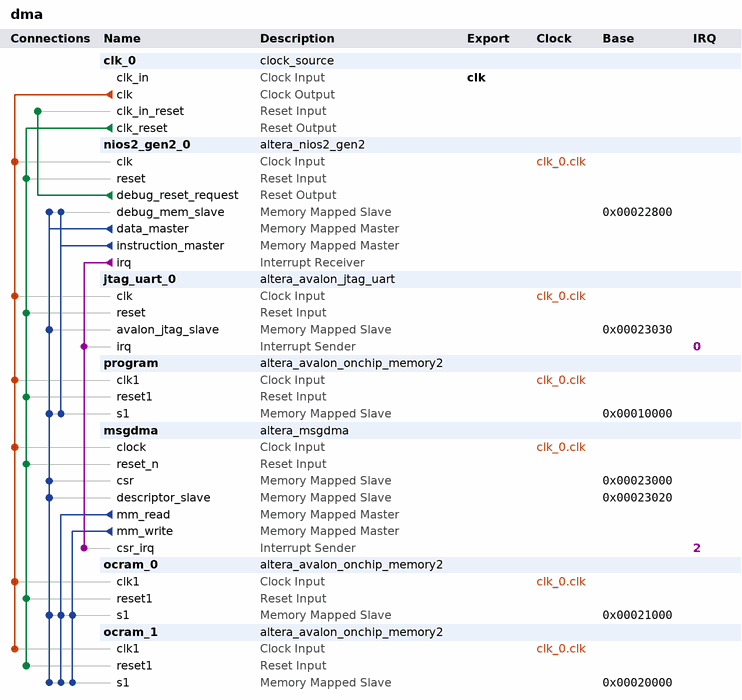
[diagram p0: system contents]
# Platform Designer (Qsys) system dma, MAX 10 10M50DAF484C6GES
# Parameters at their usual value, and those the tool derives, are not listed.
package require -exact qsys 22.1
create_system dma
set_project_property DEVICE_FAMILY {MAX 10}
set_project_property DEVICE 10M50DAF484C6GES

add_instance clk_0 clock_source 22.1
set_instance_parameter_value clk_0 clockFrequency 50000000

add_instance nios2_gen2_0 altera_nios2_gen2 22.1
set_instance_parameter_value nios2_gen2_0 dcache_size 2048
set_instance_parameter_value nios2_gen2_0 exceptionSlave program.s1
set_instance_parameter_value nios2_gen2_0 icache_size 4096
set_instance_parameter_value nios2_gen2_0 impl Fast
set_instance_parameter_value nios2_gen2_0 resetSlave program.s1

add_instance jtag_uart_0 altera_avalon_jtag_uart 22.1
set_instance_parameter_value jtag_uart_0 simInteractiveOptions NO_INTERACTIVE_WINDOWS

add_instance program altera_avalon_onchip_memory2 22.1
set_instance_parameter_value program dataWidth 32
set_instance_parameter_value program dualPort false
set_instance_parameter_value program initMemContent true
set_instance_parameter_value program initializationFileName onchip_mem.hex
set_instance_parameter_value program memorySize 40960

add_instance msgdma altera_msgdma 22.1
set_instance_parameter_value msgdma BURST_ENABLE 0
set_instance_parameter_value msgdma DATA_FIFO_DEPTH 32
set_instance_parameter_value msgdma DATA_WIDTH 32
set_instance_parameter_value msgdma DESCRIPTOR_FIFO_DEPTH 128
set_instance_parameter_value msgdma ENHANCED_FEATURES 0
set_instance_parameter_value msgdma ERROR_ENABLE 0
set_instance_parameter_value msgdma MAX_BURST_COUNT 2
set_instance_parameter_value msgdma MAX_BYTE 1024
set_instance_parameter_value msgdma MODE 0
set_instance_parameter_value msgdma PACKET_ENABLE 0
set_instance_parameter_value msgdma TRANSFER_TYPE {Aligned Accesses}

add_instance ocram_0 altera_avalon_onchip_memory2 22.1
set_instance_parameter_value ocram_0 dataWidth 32
set_instance_parameter_value ocram_0 dualPort false
set_instance_parameter_value ocram_0 initMemContent true
set_instance_parameter_value ocram_0 initializationFileName onchip_mem.hex
set_instance_parameter_value ocram_0 memorySize 4096

add_instance ocram_1 altera_avalon_onchip_memory2 22.1
set_instance_parameter_value ocram_1 dataWidth 32
set_instance_parameter_value ocram_1 dualPort false
set_instance_parameter_value ocram_1 initMemContent true
set_instance_parameter_value ocram_1 initializationFileName onchip_mem.hex
set_instance_parameter_value ocram_1 memorySize 4096

# connections
add_connection clk_0.clk jtag_uart_0.clk clock
add_connection clk_0.clk msgdma.clock clock
add_connection clk_0.clk nios2_gen2_0.clk clock
add_connection clk_0.clk ocram_0.clk1 clock
add_connection clk_0.clk ocram_1.clk1 clock
add_connection clk_0.clk program.clk1 clock
add_connection clk_0.clk_reset jtag_uart_0.reset reset
add_connection clk_0.clk_reset msgdma.reset_n reset
add_connection clk_0.clk_reset nios2_gen2_0.reset reset
add_connection clk_0.clk_reset ocram_0.reset1 reset
add_connection clk_0.clk_reset ocram_1.reset1 reset
add_connection clk_0.clk_reset program.reset1 reset
add_connection nios2_gen2_0.debug_reset_request clk_0.clk_in_reset reset
add_connection msgdma.mm_read ocram_0.s1 avalon
set_connection_parameter_value msgdma.mm_read/ocram_0.s1 baseAddress 0x00021000
add_connection msgdma.mm_read ocram_1.s1 avalon
set_connection_parameter_value msgdma.mm_read/ocram_1.s1 baseAddress 0x00020000
add_connection msgdma.mm_write ocram_0.s1 avalon
set_connection_parameter_value msgdma.mm_write/ocram_0.s1 baseAddress 0x00021000
add_connection msgdma.mm_write ocram_1.s1 avalon
set_connection_parameter_value msgdma.mm_write/ocram_1.s1 baseAddress 0x00020000
add_connection nios2_gen2_0.data_master jtag_uart_0.avalon_jtag_slave avalon
set_connection_parameter_value nios2_gen2_0.data_master/jtag_uart_0.avalon_jtag_slave baseAddress 0x00023030
add_connection nios2_gen2_0.data_master msgdma.csr avalon
set_connection_parameter_value nios2_gen2_0.data_master/msgdma.csr baseAddress 0x00023000
add_connection nios2_gen2_0.data_master msgdma.descriptor_slave avalon
set_connection_parameter_value nios2_gen2_0.data_master/msgdma.descriptor_slave baseAddress 0x00023020
add_connection nios2_gen2_0.data_master nios2_gen2_0.debug_mem_slave avalon
set_connection_parameter_value nios2_gen2_0.data_master/nios2_gen2_0.debug_mem_slave baseAddress 0x00022800
add_connection nios2_gen2_0.data_master ocram_0.s1 avalon
set_connection_parameter_value nios2_gen2_0.data_master/ocram_0.s1 baseAddress 0x00021000
add_connection nios2_gen2_0.data_master ocram_1.s1 avalon
set_connection_parameter_value nios2_gen2_0.data_master/ocram_1.s1 baseAddress 0x00020000
add_connection nios2_gen2_0.data_master program.s1 avalon
set_connection_parameter_value nios2_gen2_0.data_master/program.s1 baseAddress 0x00010000
add_connection nios2_gen2_0.instruction_master nios2_gen2_0.debug_mem_slave avalon
set_connection_parameter_value nios2_gen2_0.instruction_master/nios2_gen2_0.debug_mem_slave baseAddress 0x00022800
add_connection nios2_gen2_0.instruction_master program.s1 avalon
set_connection_parameter_value nios2_gen2_0.instruction_master/program.s1 baseAddress 0x00010000
add_connection nios2_gen2_0.irq jtag_uart_0.irq interrupt
set_connection_parameter_value nios2_gen2_0.irq/jtag_uart_0.irq irqNumber 0
add_connection nios2_gen2_0.irq msgdma.csr_irq interrupt
set_connection_parameter_value nios2_gen2_0.irq/msgdma.csr_irq irqNumber 2

# exported interfaces
add_interface clk clock sink
set_interface_property clk EXPORT_OF clk_0.clk_in

set_interconnect_requirement {$system} qsys_mm.clockCrossingAdapter HANDSHAKE
set_interconnect_requirement {$system} qsys_mm.enableEccProtection FALSE
set_interconnect_requirement {$system} qsys_mm.insertDefaultSlave FALSE
set_interconnect_requirement {$system} qsys_mm.maxAdditionalLatency 1

save_system dma.qsys
